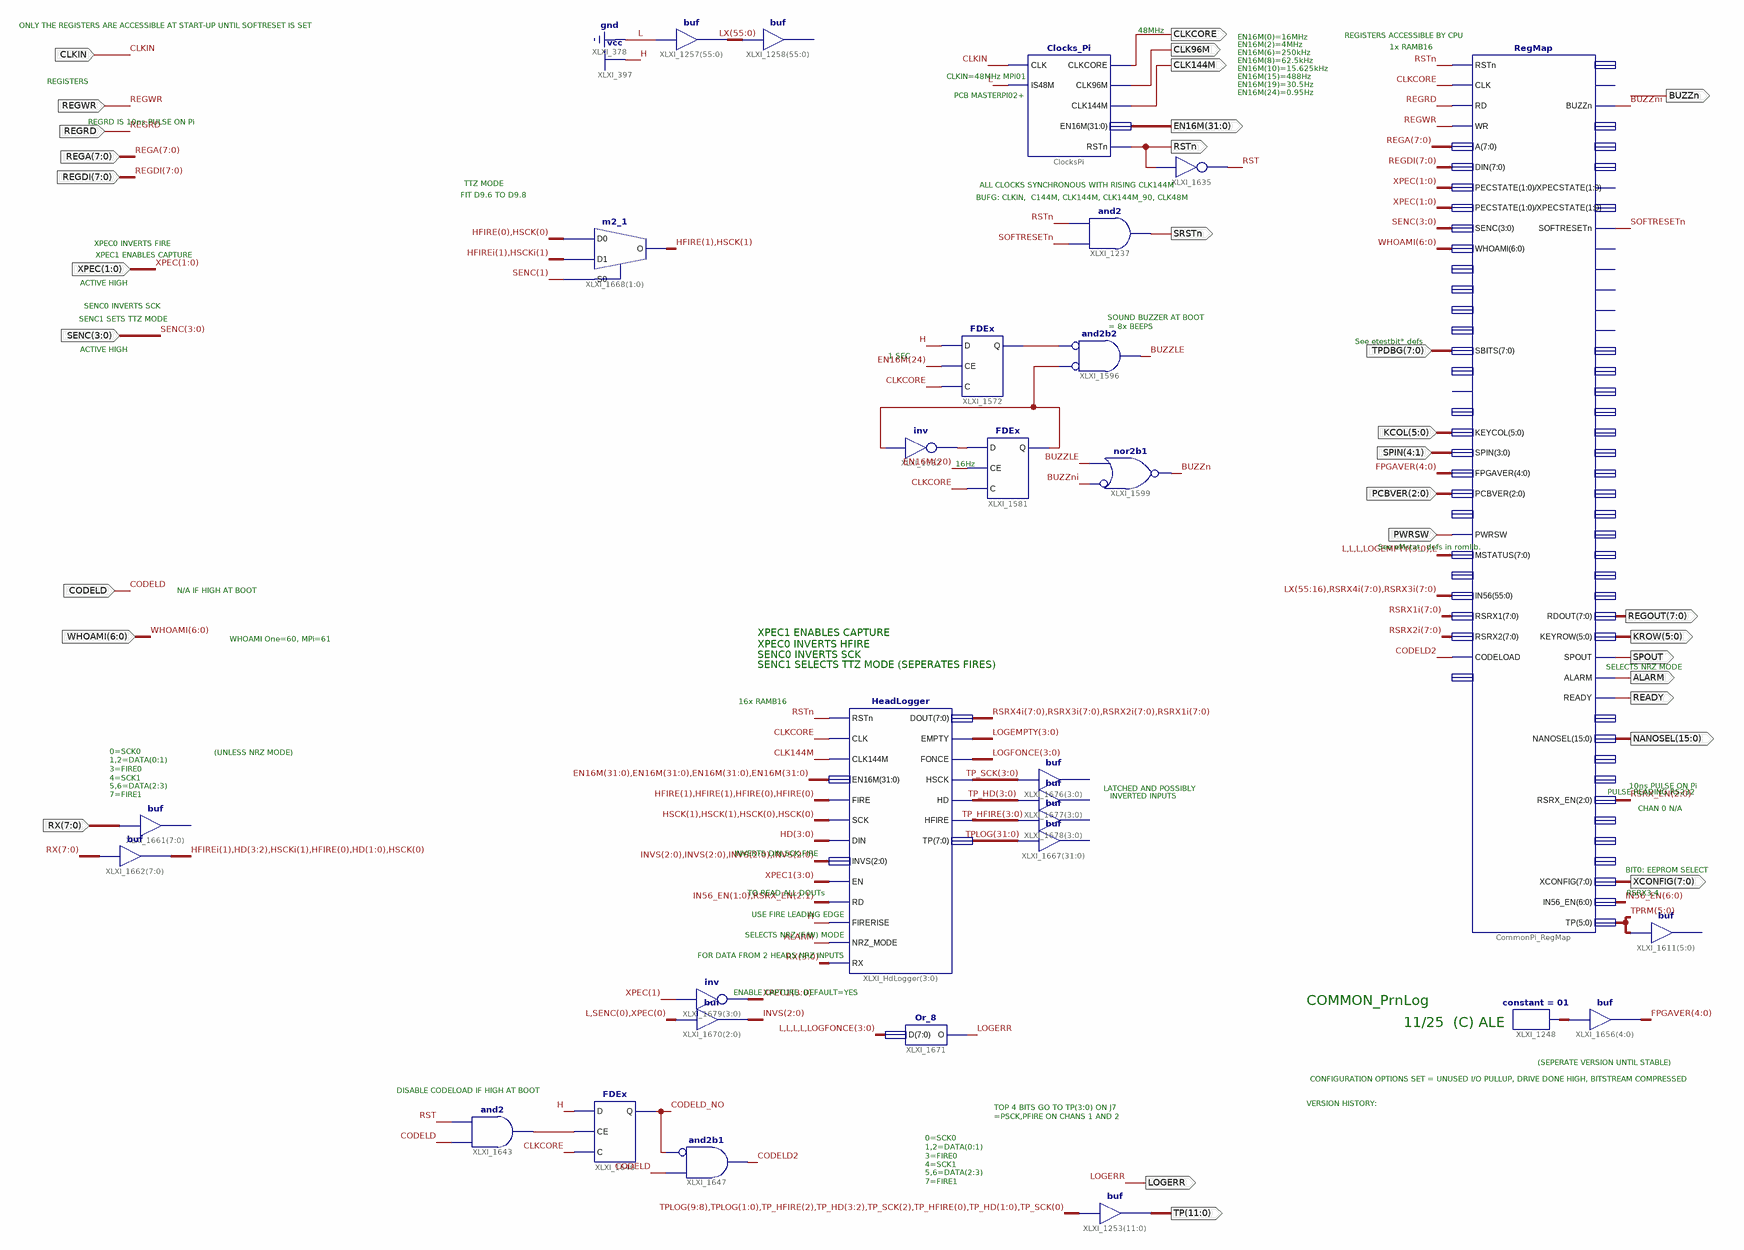
[diagram p0: schematic sheet 1]
// Xilinx ISE schematic Common_PrnLog.sch (spartan6) as structural Verilog: 29 symbols, 31 ports
module Common_PrnLog (
  input  [6:0] WHOAMI,
  input  [7:0] REGA,
  input  [7:0] REGDI,
  input  REGWR,
  input  REGRD,
  input  CLKIN,
  input  CODELD,
  input  [2:0] PCBVER,
  input  [5:0] KCOL,
  input  PWRSW,
  input  [4:1] SPIN,
  input  [3:0] SENC,
  input  [1:0] XPEC,
  input  [7:0] RX,
  input  [7:0] TPDBG,
  output CLKCORE,
  output RSTn,
  output SRSTn,
  output BUZZn,
  output [31:0] EN16M,
  output [5:0] KROW,
  output ALARM,
  output READY,
  output SPOUT,
  output CLK96M,
  output [7:0] XCONFIG,
  output CLK144M,
  output [11:0] TP,
  output [7:0] REGOUT,
  output [15:0] NANOSEL,
  output LOGERR
);

  wire BUZZLE, BUZZni, CODELD2, CODELD_NO, RST, SOFTRESETn, XLXN_1749, XLXN_1760, XLXN_1798, XLXN_1878;
  wire [1:0] HFIRE, HSCK;
  wire [1:1] HFIREi, HSCKi;
  wire [2:0] INVS, RSRX_EN;
  wire [3:0] HD, LOGEMPTY, LOGFONCE, TP_HD, TP_HFIRE, TP_SCK, XPEC1;
  wire [4:0] FPGAVER, XLXN_1886;
  wire [5:0] TPRM;
  wire [6:0] IN56_EN;
  wire [7:0] RSRX1i, RSRX2i, RSRX3i, RSRX4i;
  wire [31:0] TPLOG;
  wire [55:0] LX;

  and XLXI_1237 (SRSTn, SOFTRESETn, RSTn);
  Clocks_Pi ClocksPi (
    .CLK(CLKIN), .CLK144M(CLK144M), .CLK96M(CLK96M), .CLKCORE(CLKCORE), .EN16M(EN16M), .IS48M(1'b0),
    .RSTn(RSTn));
  FDEx XLXI_1572 (.C(CLKCORE), .CE(EN16M[24]), .D(1'b1), .Q(XLXN_1749));
  and XLXI_1596 (BUZZLE, ~XLXN_1798, ~XLXN_1749);  // and2b2
  not XLXI_1582 (XLXN_1760, XLXN_1798);
  FDEx XLXI_1581 (.C(CLKCORE), .CE(EN16M[20]), .D(XLXN_1760), .Q(XLXN_1798));
  nor XLXI_1599 (BUZZn, ~BUZZni, BUZZLE);  // nor2b1
  not XLXI_1635 (RST, RSTn);
  assign LX = {56{1'b0}};  // buf XLXI_1257[55..0], 56 bits wide
  // buf XLXI_1258[55..0] has open pins: I=LX, O=open
  assign TP = {TPLOG[9:8], TPLOG[1:0], TP_HFIRE[2], TP_HD[3:2], TP_SCK[2], TP_HFIRE[0], TP_HD[1:0], TP_SCK[0]};  // buf XLXI_1253[11..0], 12 bits wide
  assign FPGAVER = XLXN_1886;  // buf XLXI_1656[4..0], 5 bits wide
  constant #(.CValue("01")) XLXI_1248 (.O(XLXN_1886));
  m2_1 XLXI_1668[1:0] (.D0({HFIRE[0], HSCK[0]}), .D1({HFIREi[1], HSCKi[1]}), .S0(SENC[1]), .O({HFIRE[1], HSCK[1]}));
  // buf XLXI_1661[7..0] has open pins: I=RX, O=open
  assign {HFIREi[1], HD[3:2], HSCKi[1], HFIRE[0], HD[1:0], HSCK[0]} = RX;  // buf XLXI_1662[7..0], 8 bits wide
  assign INVS = {1'b0, SENC[0], XPEC[0]};  // buf XLXI_1670[2..0], 3 bits wide
  Or_8 XLXI_1671 (.D({4'b0000, LOGFONCE}), .O(LOGERR));
  RegMap CommonPi_RegMap (
    .A(REGA), .ALARM(ALARM), .BUZZn(BUZZni), .CLK(CLKCORE), .CODELOAD(CODELD2), .DIN(REGDI),
    .FPGAVER(FPGAVER), .IN56({LX[55:16], RSRX4i, RSRX3i}), .IN56_EN(IN56_EN), .KEYCOL(KCOL), .KEYROW(KROW),
    .MSTATUS({3'b000, LOGEMPTY, 1'b0}), .NANOSEL(NANOSEL), .PCBVER(PCBVER), .PECSTATE(XPEC), .PWRSW(PWRSW),
    .RD(REGRD), .RDOUT(REGOUT), .READY(READY), .RSRX1(RSRX1i), .RSRX2(RSRX2i), .RSRX_EN(RSRX_EN),
    .RSTn(RSTn), .SBITS(TPDBG), .SENC(SENC), .SOFTRESETn(SOFTRESETn), .SPIN(SPIN), .SPOUT(SPOUT), .TP(TPRM),
    .WHOAMI(WHOAMI), .WR(REGWR), .XCONFIG(XCONFIG), .XPECSTATE(XPEC));  // open: BAUD21, DIV, DIVFRESH, EXTERNAL, HCONF16X8, HD, HDCONFIG, HEADSM1, HOLDEN, HREG, HREG0, HREGSEL, HREGSEL_EN, INVERT, IRQACK, IRQCLR, IRQEN, IRQMASKn, IRQPEND, MAXFREQ, NEWTRIG, PECINV, RASEN, RASPNTA, RASPNTB, RASTRIGA, RASTRIGB, REGIN, REGINSEL, RSRXHD, RSTX1, RSTX2, RSTXHD, RSTX_EN, SRACC, TICKLE8, TICKLEVEL, TICKRUN, TICK_976_172, TPDBG28, TTZMODE
  // buf XLXI_1611[5..0] has open pins: I=TPRM, O=open
  HeadLogger XLXI_HdLogger[3:0] (
    .CLK(CLKCORE), .CLK144M(CLK144M), .DIN(HD), .DOUT({RSRX4i, RSRX3i, RSRX2i, RSRX1i}), .EMPTY(LOGEMPTY),
    .EN(XPEC1), .EN16M({EN16M, EN16M, EN16M, EN16M}), .FIRE({{2{HFIRE[1]}}, {2{HFIRE[0]}}}), .FIRERISE(1'b1),
    .FONCE(LOGFONCE), .HD(TP_HD), .HFIRE(TP_HFIRE), .HSCK(TP_SCK), .INVS({INVS, INVS, INVS, INVS}),
    .NRZ_MODE(ALARM), .RD({IN56_EN[1:0], RSRX_EN[2:1]}), .RSTn(RSTn), .RX(RX[3:0]),
    .SCK({{2{HSCK[1]}}, {2{HSCK[0]}}}), .TP(TPLOG));
  // buf XLXI_1667[31..0] has open pins: I=TPLOG, O=open
  // buf XLXI_1678[3..0] has open pins: I=TP_HFIRE, O=open
  // buf XLXI_1677[3..0] has open pins: I=TP_HD, O=open
  // buf XLXI_1676[3..0] has open pins: I=TP_SCK, O=open
  FDEx XLXI_1646 (.C(CLKCORE), .CE(XLXN_1878), .D(1'b1), .Q(CODELD_NO));
  and XLXI_1647 (CODELD2, ~CODELD_NO, CODELD);  // and2b1
  and XLXI_1643 (XLXN_1878, CODELD, RST);
  assign XPEC1 = ~{4{XPEC[1]}};  // inv XLXI_1679[3..0], 4 bits wide

  // Notes on the sheet:
  //   ONLY THE REGISTERS ARE ACCESSIBLE AT START-UP UNTIL SOFTRESET IS SET
  //   48MHz
  //   REGISTERS ACCESSIBLE BY CPU
  //   EN16M(0)=16MHz
  //   EN16M(2)=4MHz
  //   1x RAMB16
  //   EN16M(6)=250kHz
  //   EN16M(8)=62.5kHz
  //   EN16M(10)=15.625kHz
  //   CLKIN=48MHz MPi01
  //   EN16M(15)=488Hz
  //   REGISTERS
  //   EN16M(19)=30.5Hz
  //   EN16M(24)=0.95Hz
  //   PCB MASTERPI02+
  //   REGRD IS 10ns PULSE ON Pi
  //   TTZ MODE
  //   ALL CLOCKS SYNCHRONOUS WITH RISING CLK144M
  //   FIT D9.6 TO D9.8
  //   BUFG: CLKIN,  C144M, CLK144M, CLK144M_90, CLK48M
  //   XPEC0 INVERTS FIRE
  //   XPEC1 ENABLES CAPTURE
  //   ACTIVE HIGH
  //   SENC0 INVERTS SCK
  //   SOUND BUZZER AT BOOT
  //   SENC1 SETS TTZ MODE
  //   = 8x BEEPS
  //   See etestbit* defs
  //   ACTIVE HIGH
  //   1 SEC
  //   16Hz
  //   See eMstat_ defs in romlib.
  //   N/A IF HIGH AT BOOT
  //   XPEC1 ENABLES CAPTURE
  //   WHOAMI One=60, MPi=61
  //   XPEC0 INVERTS HFIRE
  //   SENC0 INVERTS SCK
  //   SENC1 SELECTS TTZ MODE (SEPERATES FIRES)
  //   SELECTS NRZ MODE
  //   16x RAMB16
  //   0=SCK0
  //   (UNLESS NRZ MODE)
  //   1,2=DATA(0:1)
  //   3=FIRE0
  //   4=SCK1
  //   5,6=DATA(2:3)
  //   10ns PULSE ON Pi
  //   LATCHED AND POSSIBLY
  //   PULSE READING RS232
  //   7=FIRE1
  //   INVERTED INPUTS
  //   CHAN 0 N/A
  //   INVERTS DIN,SCK,FIRE
  //   BIT0: EEPROM SELECT
  //   TO READ ALL DOUTs
  //   RSRX3,4
  //   USE FIRE LEADING EDGE
  //   SELECTS NRZ (F/W) MODE
  //   FOR DATA FROM 2 HEADS NRZ INPUTS
  //   ENABLE CAPTURE. DEFAULT=YES
  //   COMMON_PrnLog
  //   11/25  (C) ALE
  //   (SEPERATE VERSION UNTIL STABLE)
  //   CONFIGURATION OPTIONS SET = UNUSED I/O PULLUP, DRIVE DONE HIGH, BITSTREAM COMPRESSED
  //   DISABLE CODELOAD IF HIGH AT BOOT
  //   VERSION HISTORY:
  //   TOP 4 BITS GO TO TP(3:0) ON J7
  //   =PSCK,PFIRE ON CHANS 1 AND 2
  //   0=SCK0
  //   1,2=DATA(0:1)
  //   3=FIRE0
  //   4=SCK1
  //   5,6=DATA(2:3)
  //   7=FIRE1
endmodule
